# Altium schematic sheet Sensing_ADC_Buffering.SchDoc
size A4; Organization: Waterloop; Address1: 200 University Ave W; Address2: Engineering 5, 1104; Address3: Waterloo, ON; Address4: N2L 3G1; DocumentNumber: 4; SheetNumber: 4; SheetTotal: 5
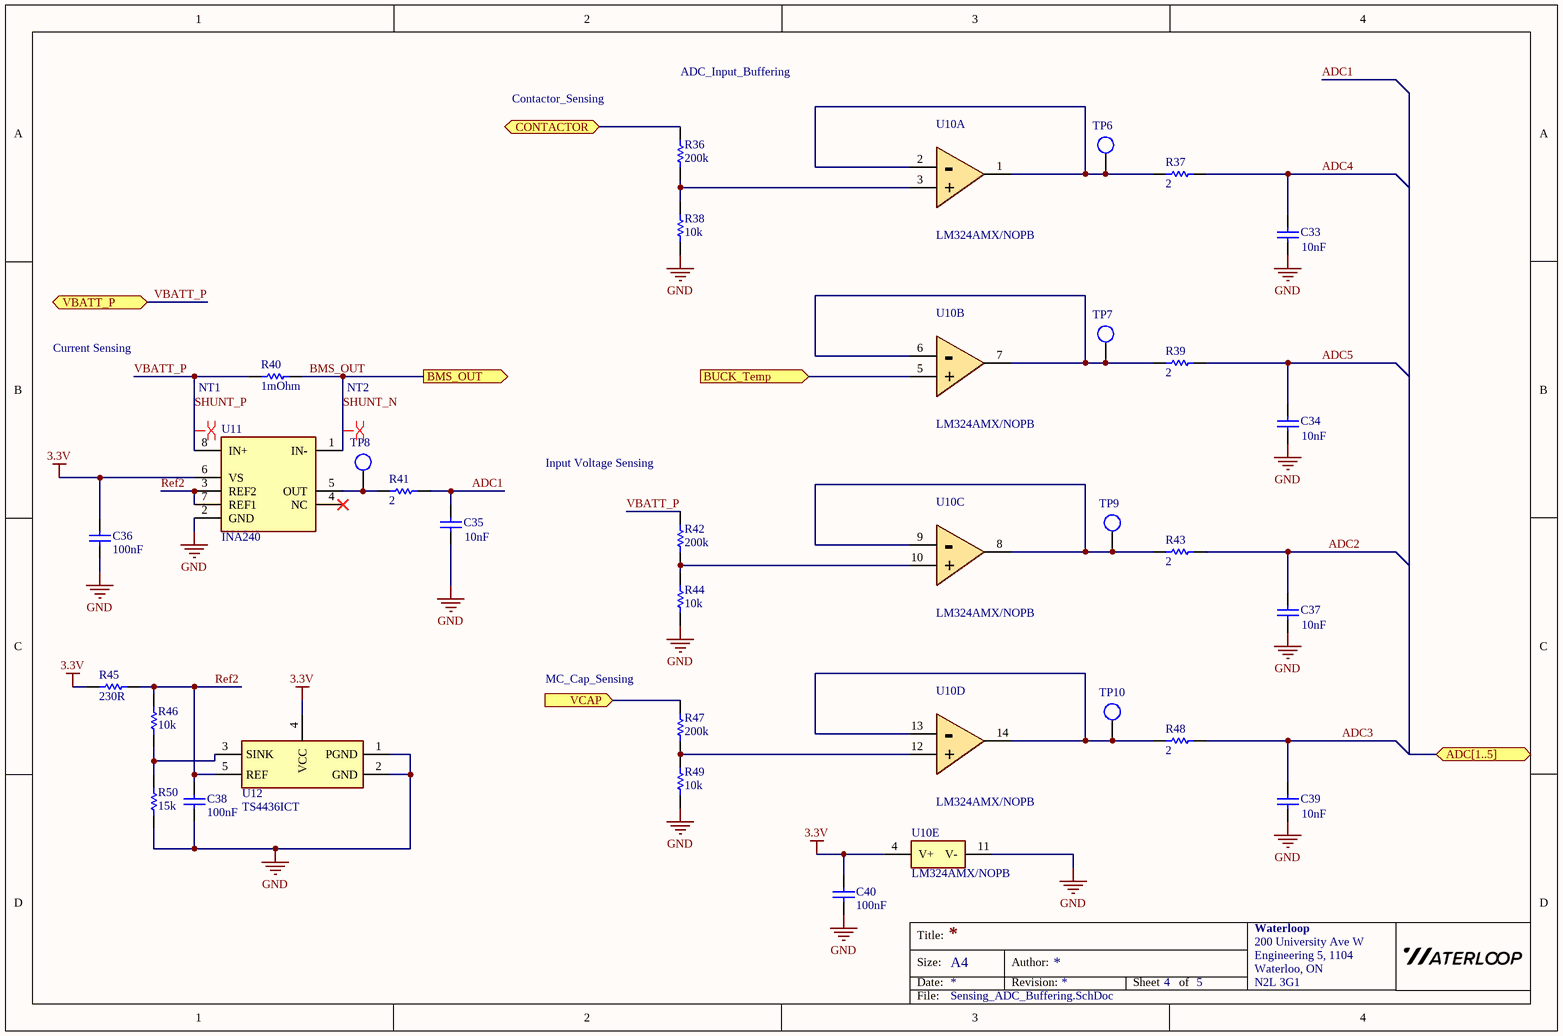
[diagram p0: Sensing_ADC_Buffering.SchDoc]

## Parts
C33  value 10nF  [0805 - Capacitor]  (hidden comment: Capacitor - Nonpolarized)
C34  value 10nF  [0805 - Capacitor]  (hidden comment: Capacitor - Nonpolarized)
C35  value 10nF  [0805 - Capacitor]  (hidden comment: Capacitor - Nonpolarized)
C36  value 100nF  [0805 - Capacitor]  (hidden comment: Capacitor - Nonpolarized)
C37  value 10nF  [0805 - Capacitor]  (hidden comment: Capacitor - Nonpolarized)
C38  value 100nF  [0805 - Capacitor]  (hidden comment: Capacitor - Nonpolarized)
C39  value 10nF  [0805 - Capacitor]  (hidden comment: Capacitor - Nonpolarized)
C40  value 100nF  [0805 - Capacitor]  (hidden comment: Capacitor - Nonpolarized)
NT1  NetTie  [Net Tie]  (value not drawn)  (net tie, no BOM)
NT2  NetTie  [Net Tie]  (value not drawn)  (net tie, no BOM)
R36  value 200k  [0603 - Resistor]  (hidden comment: Res)
R37  value 2  [0603 - Resistor]  (hidden comment: Resistor)
R38  value 10k  [0603 - Resistor]  (hidden comment: Res2)
R39  value 2  [0603 - Resistor]  (hidden comment: Resistor)
R40  value 1mOhm  [2512 - RESISTOR]  (hidden comment: Resistor)
R41  value 2  [0603 - Resistor]  (hidden comment: Resistor)
R42  value 200k  [0603 - Resistor]  (hidden comment: Res)
R43  value 2  [0603 - Resistor]  (hidden comment: Resistor)
R44  value 10k  [0603 - Resistor]  (hidden comment: Res2)
R45  value 230R  [0603 - Resistor]  (hidden comment: Res2)
R46  value 10k  [0603 - Resistor]  (hidden comment: Res2)
R47  200k  [0603 - Resistor]
R48  value 2  [0603 - Resistor]  (hidden comment: Resistor)
R49  10k  [0603 - Resistor]
R50  value 15k  [0603 - Resistor]  (hidden comment: Res2)
TP6  (no value)  [Test Point - 5002]  (no BOM)
TP7  (no value)  [Test Point - 5002]  (no BOM)
TP8  (no value)  [Test Point - 5002]  (no BOM)
TP9  (no value)  [Test Point - 5002]  (no BOM)
TP10  (no value)  [Test Point - 5002]  (no BOM)
U10  LM324AMX/NOPB  [LM324AMX/NOPB]  (parts A,B,C,D,E of 5)
U11  INA240  [INA240]
U12  TS4436ICT  [SOT323]

## Ports
ADC[1..5] (bidir), BMS_OUT (out), BUCK_Temp (in), CONTACTOR (bidir), VBATT_P (bidir), VCAP (in)

## Nets
3.3V: C36.2 C40.2 R45.2 U10.4(V+) U11.6(VS) U12.4(VCC)
GND: C33.1 C34.1 C35.1 C36.1 C37.1 C38.1 C39.1 C40.1 R38.1 R44.1 R49.1 R50.2 U10.11(V-) U11.2(GND) U12.1(PGND) U12.2(GND)
ADC1: C35.2 R41.2
ADC2: C37.2 R43.2
ADC3: C39.2 R48.2
ADC4: C33.2 R37.2
ADC5: C34.2 R39.2
BMS_OUT: NT2.2 R40.2 ; port BMS_OUT
BUCK_Temp: U10.5(+) ; port BUCK_Temp
CONTACTOR: R36.2 ; port CONTACTOR
Ref2: C38.2 R45.1 R46.1 U11.3(REF2) U11.7(REF1) U12.5(REF)
SHUNT_N: NT2.1 U11.1(IN-)
SHUNT_P: NT1.1 U11.8(IN+)
VBATT_P: NT1.2 R40.1 R42.2 ; port VBATT_P
VCAP: R47.2 ; port VCAP
NetR36_1: R36.1 R38.2 U10.3(+)
NetR37_1: R37.1 TP6.1 U10.1 U10.2(-)
NetR39_1: R39.1 TP7.1 U10.6(-) U10.7
NetR41_1: R41.1 TP8.1 U11.5(OUT)
NetR42_1: R42.1 R44.2 U10.10(+)
NetR43_1: R43.1 TP9.1 U10.8 U10.9(-)
NetR46_2: R46.2 R50.1 U12.3(SINK)
NetR47_1: R47.1 R49.2 U10.12(+)
NetR48_1: R48.1 TP10.1 U10.13(-) U10.14

Not connected (* = marked no-connect by the designer): U11 4(NC)*

## Layout directives
differential pair: SHUNT_N, SHUNT_P

## Notes on the sheet
- Contactor_Sensing
- ADC_Input_Buffering
- Current Sensing
- Input Voltage Sensing
- MC_Cap_Sensing
- Title:
- Size:
- Date:
- A4
- Author:
- Revision:
- Sheet
- of
- File:

## Library data of the parts
C33-C35 C37 C39 = Capacitor - Nonpolarized: CC0805JRX7R9BB103, CAP CER 10000PF 50V X7R 0805; Manufacturer: YAGEO; Manufacturer Part Number: CC0805MRX7R9BB103; Supplier Part Number: 311-4350-1-ND; Supplier: Digi-Key; Rating: 50V
C36 C38 C40 = Capacitor - Nonpolarized: CC0805KRX7R9BB104, 0.1 µF / ±10% 50V Ceramic Capacitor X7R 0805 (2012 Metric); Manufacturer: YAGEO; Supplier Part Number: 311-1140-1-ND; Supplier: Digi-Key; Rating: 50V; Manufacturer Part Number: CC0805KRX7R9BB104
NT1 NT2 = Net Tie
R36 R42 R47 = Resistor: RC0603FR-07200KL. 200 kOhms ±1% 0.1W, 1/10W Chip Resistor 0603 (1608 Metric) Thick Film; Manufacturer: YAGEO; Rating: *; Manufacturer Part Number: RC0603FR-07200KL; Supplier Part Number: 311-200KHRCT-ND; Supplier: Digi-Key
R37 R39 R41 R43 R48 = Resistor: RC0603FR-072RL, RES 2 OHM 1% 1/10W 0603; Manufacturer: YAGEO; Rating: *; Manufacturer Part Number: RC0603FR-072RL; Supplier Part Number: 311-2.00HRCT-ND; Supplier: Digi-Key
R38 R44 R46 = Resistor: ERJ-3GEYJ103V. 10 kOhms ±5% 0.1W, 1/10W Chip Resistor 0603 (1608 Metric) Automotive AEC-Q200 Thick Film; Manufacturer Part Number: RC0603FR-0710KL; Manufacturer: Yageo; Rating: 0.1W; Supplier Part Number: 311-10.0KHRCT-ND; Supplier: Digi-Key
R40 = Resistor: SCMM2512S5-R001F, RES 0.001 OHM 1% 5W 2512; Manufacturer Part Number: VSML2512S5-R001F; Manufacturer: Delta Electronics/Cyntec; Rating: 5W; Supplier Part Number: 2037-VSML2512S5-R001FCT-ND; Supplier: Digi-Key
R45 = Resistor: ERJ-3GEYJ103V. 10 kOhms ±5% 0.1W, 1/10W Chip Resistor 0603 (1608 Metric) Automotive AEC-Q200 Thick Film; Manufacturer Part Number: RC0603FR-07232RL; Manufacturer: YAGEO; Rating: 0.1W; Supplier Part Number: 311-232HRCT-ND; Supplier: Digi-Key
R49 = Resistor: ERJ-3GEYJ103V. 10 kOhms ±5% 0.1W, 1/10W Chip Resistor 0603 (1608 Metric) Automotive AEC-Q200 Thick Film; Manufacturer: Panasonic Electronic Components; Rating: *; Manufacturer Part Number: ERJ-3GEYJ103V; Supplier Part Number: P10KGCT-ND; Supplier: Digi-Key
R50 = Resistor: ERJ-3GEYJ103V. 10 kOhms ±5% 0.1W, 1/10W Chip Resistor 0603 (1608 Metric) Automotive AEC-Q200 Thick Film; Manufacturer Part Number: RC0603FR-0715KL; Manufacturer: YAGEO; Rating: 0.1W; Supplier Part Number: 311-15.0KHRCT-ND; Supplier: Digi-Key
TP6-TP10 = Test Point
U10 = LM324AMX/NOPB: LM324AMX/NOPB, Gen Purp 4Ch Opamp; Manufacturer: TI; Manufacturer Part Number: LM324AMX/NOPB; Supplier Part Number: LM324AMX/NOPBCT-ND; Supplier: Digikey; ComponentLink1Description: Datasheet; ComponentLink1URL: https://www.ti.com/lit/ds/symlink/lm124-n.pdf?HQS=dis-dk-null-digikeymode-dsf-pf-null-wwe&ts=1616555832552
U11 = INA240: INA240A2, -4V to 80V Current Sense Amplifier; Manufacturer: Texas Instruments; Manufacturer Part Number: INA240A2DR; Supplier Part Number: 296-51173-1-ND; Supplier: Digikey; ComponentLink1Description: Datasheet; ComponentLink1URL: https://www.ti.com/lit/ds/sbos662b/sbos662b.pdf
U12 = TS4436ICT: Shunt Voltage Reference IC Adjustable 0.6V 1.8 VV ±1% 20 mA SC-70-5; Manufacturer: ST; Manufacturer Part Number: TS4436ICT; Supplier Part Number: 497-TS4436ICT-ND; Supplier: Digikey; ComponentLink1Description: Datasheet; ComponentLink1URL: https://www.st.com/content/ccc/resource/technical/document/datasheet/c6/5e/50/38/17/1e/4e/fa/CD00096205.pdf/files/CD00096205.pdf/jcr:content/translations/en.CD00096205.pdf